# Altium schematic sheet ver061_Power.SchDoc
size A3; SheetNumber: 4; SheetTotal: 6
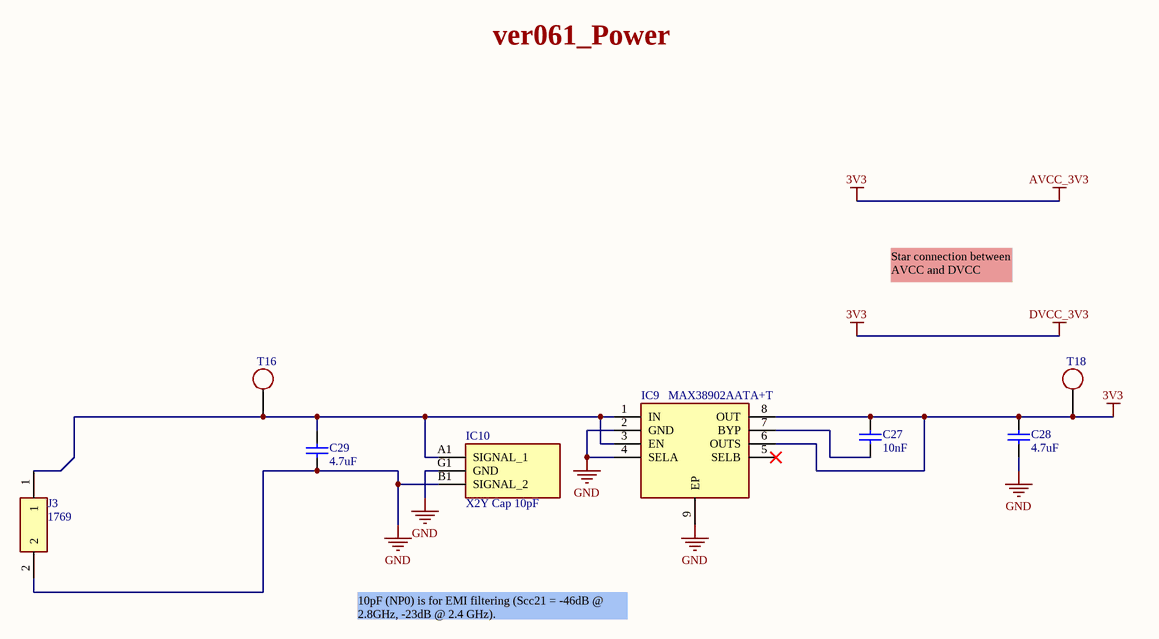
[diagram p0: ver061_Power.SchDoc]

## Parts
C27  value 10nF  [0402]  (hidden comment: Cap Semi)
C28  value 4.7uF  [0402]  (hidden comment: Cap Semi)
C29  value 4.7uF  [0402]  (hidden comment: Cap Semi)
IC9  MAX38902AATA+T  [SON50P200X200X80-9N-D]
IC10  X2Y Cap 10pF  [500X14W102MV4T]
J3  1769  [1769]
T16  TP_SMT  [TP_SMT_Round_0.6x0.6]  (value not drawn)
T18  TP_SMT  [TP_SMT_Round_0.6x0.6]  (value not drawn)

## Nets
3V3: C27.1 C28.1 IC9.6(OUTS) IC9.8(OUT) T18.1  [also labelled AVCC_3V3, DVCC_3V3]
GND: C28.2 C29.2 IC9.2(GND) IC9.4(SELA) IC9.9(EP) IC10.B1(SIGNAL_2) IC10.G1(GND) J3.2
NetC27_2: C27.2 IC9.7(BYP)
NetC29_1: C29.1 IC9.1(IN) IC9.3(EN) IC10.A1(SIGNAL_1) J3.1 T16.1

Not connected (* = marked no-connect by the designer): IC9 5(SELB)*

## Notes on the sheet
- ver061_Power
- Star connection between AVCC and DVCC
- 10pF (NP0) is for EMI filtering (Scc21 = -46dB @ 2.8GHz, -23dB @ 2.4 GHz).

## Library data of the parts
C27-C29 = Cap Semi: Capacitor (Semiconductor SIM Model); Published: 8-Jun-2000; LatestRevisionDate: 29-May-2009; LatestRevisionNote: IPC-7351 Footprint Added.; PackageReference: C1206; Publisher: Altium Limited; PackageDescription: Chip Capacitor
IC9 = MAX38902AATA+T: Integrated Circuit; Manufacturer_Name: Analog Devices; Datasheet Link: https://media.digikey.com/pdf/Data%20Sheets/Maxim%20PDFs/MAX38902A_B_C_D_Rev4_12-6-18.pdf; Height: 0.8mm; Manufacturer_Part_Number: MAX38902AATA+T; Mouser Part Number: 700-MAX38902AATA+T; Mouser Price/Stock: https://www.mouser.co.uk/ProductDetail/Maxim-Integrated/MAX38902AATA%2bT?qs=rrS6PyfT74ceu65lHXtPmw%3D%3D
IC10 = 500X14W102MV4T: Integrated Circuit; Manufacturer_Name: JOHANSON TECHNOLOGY; Datasheet Link: https://www.johansondielectrics.com/downloads/x2y-filter-and-decoupling-capacitors.pdf; Height: 0.66mm; Manufacturer_Part_Number: 500X14W102MV4T; Mouser Part Number: 605-500X14W102MV4T; Mouser Price/Stock: https://www.mouser.co.uk/ProductDetail/Johanson-Dielectrics/500X14W102MV4T?qs=yCnrNFeXz%252Bg%252BGvc939b0KQ%3D%3D
J3 = 1769: Connector; Manufacturer_Name: Adafruit; Datasheet Link: https://cdn-shop.adafruit.com/datasheets/17311.pdf; Manufacturer_Part_Number: 1769; Mouser Part Number: 485-1769; Mouser Price/Stock: https://www.mouser.co.uk/ProductDetail/Adafruit/1769?qs=GURawfaeGuBbgoGtf2XstA%3D%3D; Arrow Part Number: 1769; Arrow Price/Stock: https://www.arrow.com/en/products/1769/adafruit-industries?region=nac